# EAGLE design MotorShieldTestbench (EAGLE 8.1.1)
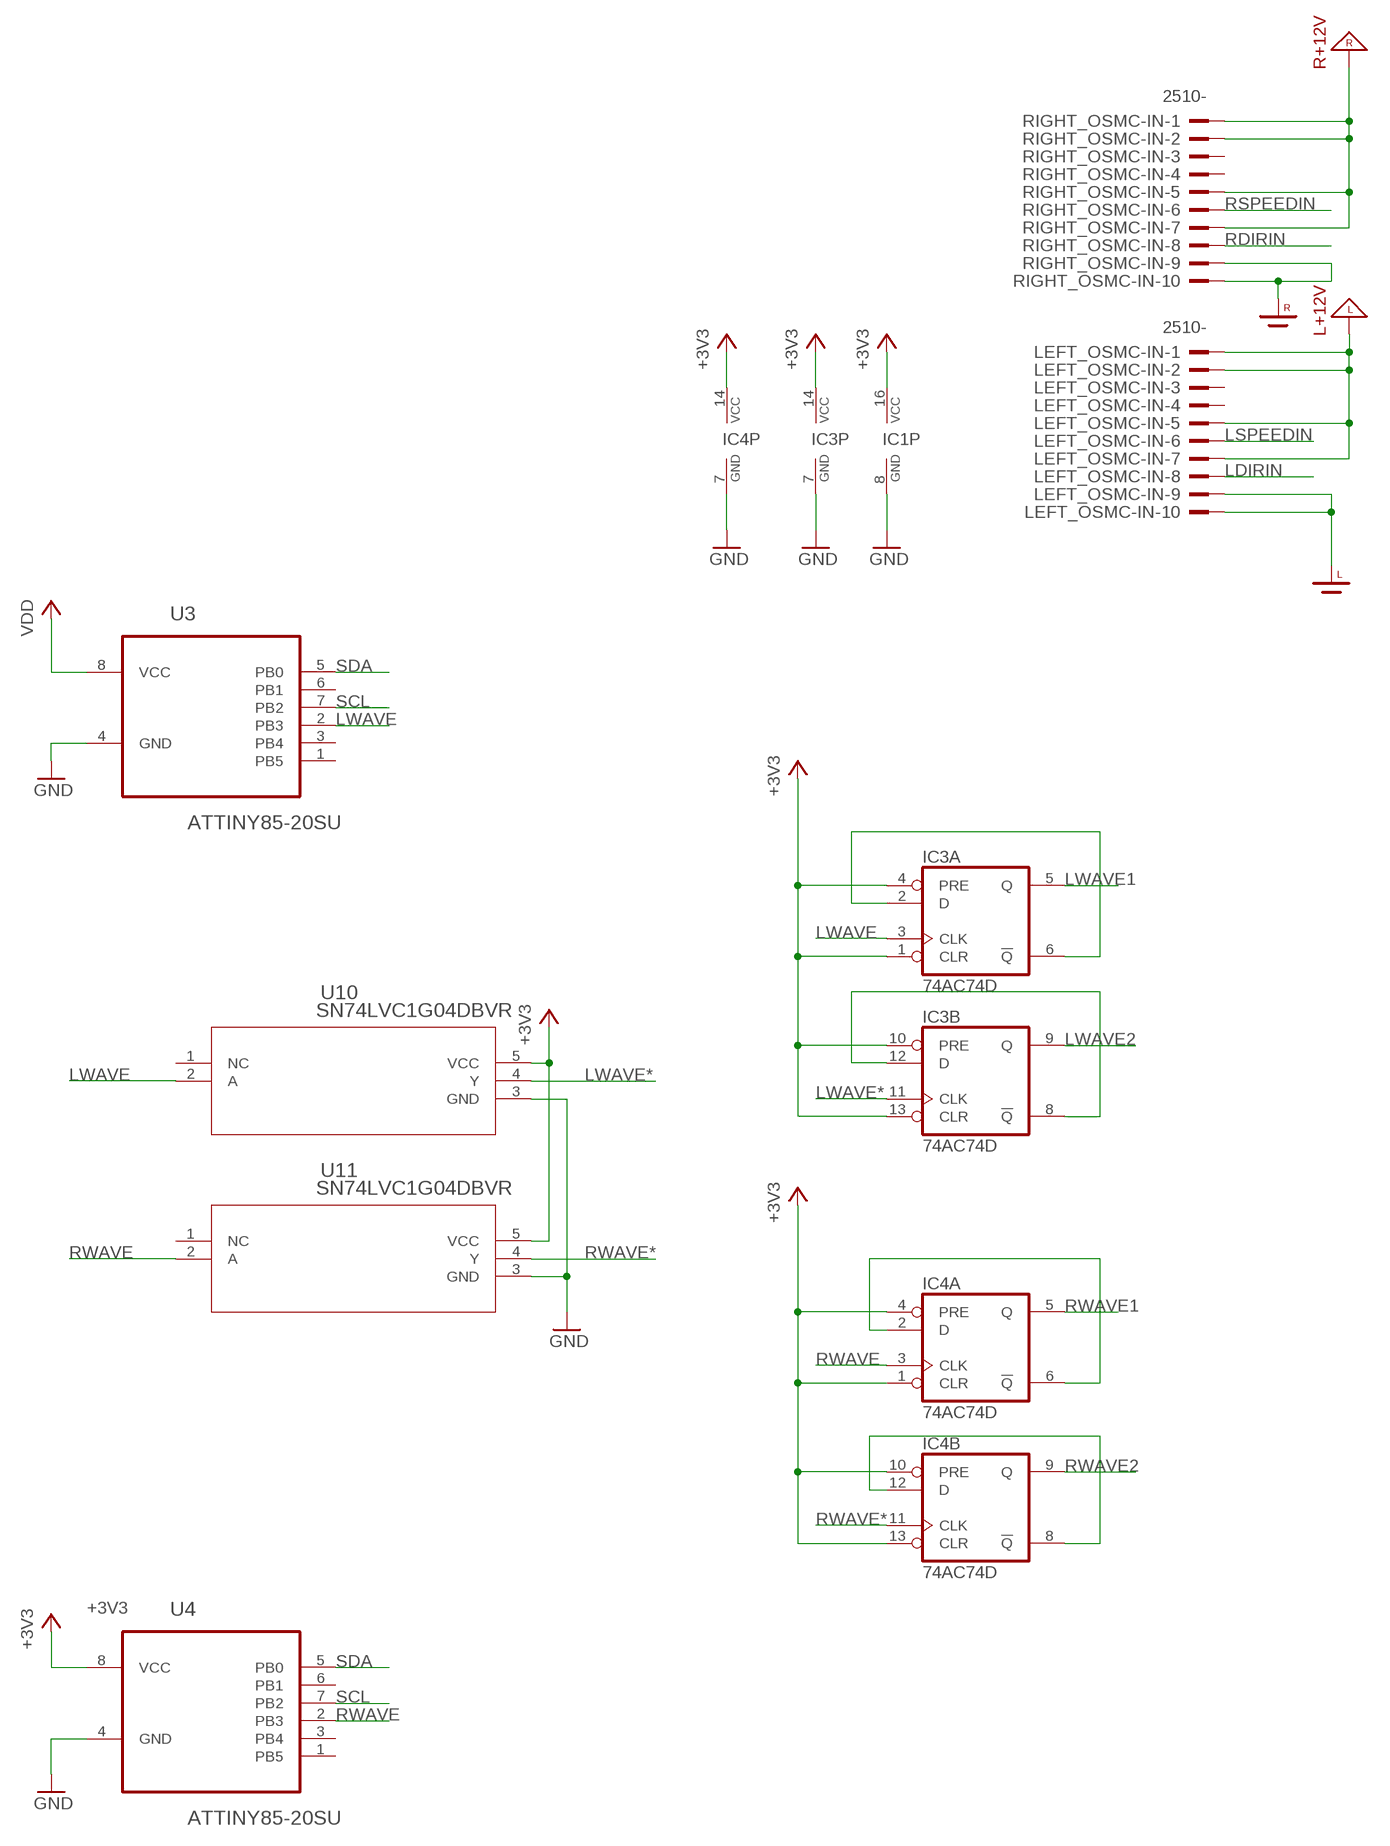
[diagram p0: schematic, sheet 1, part 1 of 2]
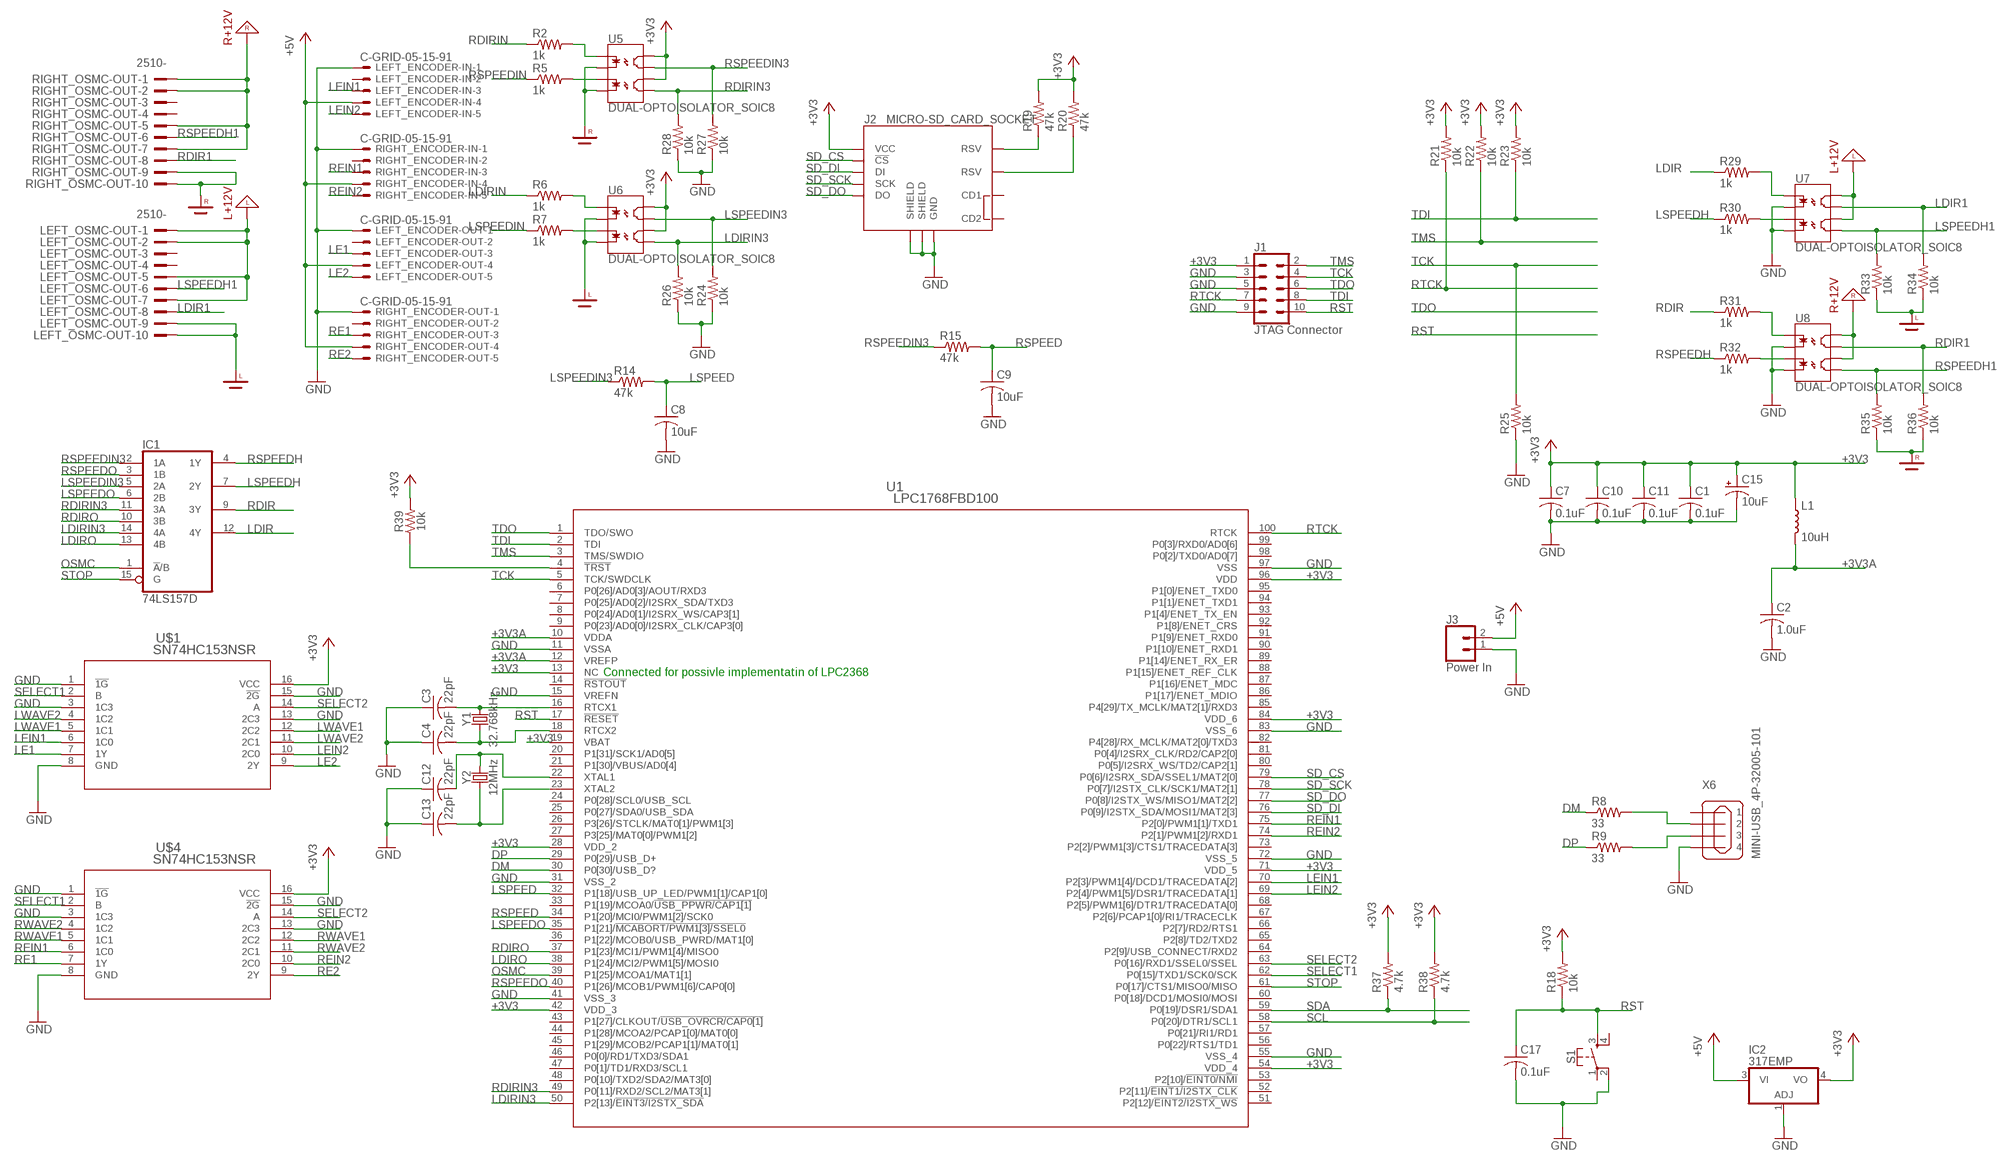
[diagram p1: schematic, sheet 1, part 2 of 2]

## Parts
C1  0.1uF  C-USC0603  [C0603]
C2  1.0uF  C-USC0603  [C0603]
C3  22pF  C-USC0603  [C0603]
C4  22pF  C-USC0603  [C0603]
C7  0.1uF  C-USC0603  [C0603]
C8  10uF  C-USC0603  [C0603]
C9  10uF  C-USC0603  [C0603]
C10  0.1uF  C-USC0603  [C0603]
C11  0.1uF  C-USC0603  [C0603]
C12  22pF  C-USC0603  [C0603]
C13  22pF  C-USC0603  [C0603]
C15  10uF  10UF-POLAR-0603-6.3V-20%(TANT)  [0603-POLAR]
C17  0.1uF  C-USC0603  [C0603]
IC1  74LS157D  [SO16]
IC2  317EMP  [SOT223]
IC3  74AC74D  [SO14]
IC4  74AC74D  [SO14]
J1  JTAG Connector  CONN_05X2SHD  [2X5-SHROUDED]
J2  MICRO-SD_CARD_SOCKET  [MICRO-SD-SOCKET]
J3  Power In  CONN_02POLAR  [MOLEX-1X2]
L1  10uH  INDUCTOR-0603-33NH  [0603]
LEFT_ENCODER-IN  C-GRID-05-15-91  [15-91-05]
LEFT_ENCODER-OUT  C-GRID-05-15-91  [15-91-05]
LEFT_OSMC-IN  2510-  [PAK100/2500-10]
LEFT_OSMC-OUT  2510-  [PAK100/2500-10]
R2  1k  R-US_R0603  [R0603]
R5  1k  R-US_R0603  [R0603]
R6  1k  R-US_R0603  [R0603]
R7  1k  R-US_R0603  [R0603]
R8  33  R-US_R0603  [R0603]
R9  33  R-US_R0603  [R0603]
R14  47k  R-US_R0603  [R0603]
R15  47k  R-US_R0603  [R0603]
R18  10k  R-US_R0603  [R0603]
R19  47k  R-US_R0603  [R0603]
R20  47k  R-US_R0603  [R0603]
R21  10k  R-US_R0603  [R0603]
R22  10k  R-US_R0603  [R0603]
R23  10k  R-US_R0603  [R0603]
R24  10k  R-US_R0603  [R0603]
R25  10k  R-US_R0603  [R0603]
R26  10k  R-US_R0603  [R0603]
R27  10k  R-US_R0603  [R0603]
R28  10k  R-US_R0603  [R0603]
R29  1k  R-US_R0603  [R0603]
R30  1k  R-US_R0603  [R0603]
R31  1k  R-US_R0603  [R0603]
R32  1k  R-US_R0603  [R0603]
R33  10k  R-US_R0603  [R0603]
R34  10k  R-US_R0603  [R0603]
R35  10k  R-US_R0603  [R0603]
R36  10k  R-US_R0603  [R0603]
R37  4.7k  R-US_R0603  [R0603]
R38  4.7k  R-US_R0603  [R0603]
R39  10k  10KOHM-0603-1/10W-1%  [0603]
RIGHT_ENCODER-IN  C-GRID-05-15-91  [15-91-05]
RIGHT_ENCODER-OUT  C-GRID-05-15-91  [15-91-05]
RIGHT_OSMC-IN  2510-  [PAK100/2500-10]
RIGHT_OSMC-OUT  2510-  [PAK100/2500-10]
S1  MOMENTARY-SWITCH-SPST-2-SMD-5.2MM  [TACTILE_SWITCH_SMD_5.2MM]
U1  LPC1768FBD100  [SOT407-1]
U3  ATTINY85-20SU  [SOIC127P798X216-8N]
U4  ATTINY85-20SU  [SOIC127P798X216-8N]
U5  DUAL-OPTOISOLATOR_SOIC8  [SO08]
U6  DUAL-OPTOISOLATOR_SOIC8  [SO08]
U7  DUAL-OPTOISOLATOR_SOIC8  [SO08]
U8  DUAL-OPTOISOLATOR_SOIC8  [SO08]
U10  SN74LVC1G04DBVR  [DBV5]
U11  SN74LVC1G04DBVR  [DBV5]
U$1  SN74HC153NSR  [NS16]
U$4  SN74HC153NSR  [NS16]
X6  MINI-USB_4P-32005-101  [32005-101]
Y1  32.768kHz  CRYSTAL-32.768KHZSMD-3.2X1.5  [CRYSTAL-SMD-3.2X1.5MM]
Y2  12MHz  CRYSTAL-12MHZ"  [CRYSTAL-SMD-5X3.2-4PAD]

## Nets
+3V3: C1.1 C7.1 C10.1 C11.1 C15.+ IC1.16(VCC) IC2.4(VO) IC3.1(A:CLR) IC3.4(A:PRE) IC3.10(B:PRE) IC3.13(B:CLR) IC3.14(P:VCC) IC4.1(A:CLR) IC4.4(A:PRE) IC4.10(B:PRE) IC4.13(B:CLR) IC4.14(P:VCC) J1.1 J2.VCC L1.1 R18.2 R19.2 R20.2 R21.2 R22.2 R23.2 R37.2 R38.2 R39.2 U1.13(NC) U1.19(VBAT) U1.28(VDD_2) U1.42(VDD_3) U1.54(VDD_4) U1.71(VDD_5) U1.84(VDD_6) U1.96(VDD) U3.8(VCC) U4.8(VCC) U5.6(CL2) U5.8(CL1) U6.6(CL2) U6.8(CL1) U10.5(VCC) U11.5(VCC) U$1.16(VCC) U$4.16(VCC) ; supply symbol labelled VDD
+3V3A: C2.1 L1.2 U1.10(VDDA) U1.12(VREFP)
+5V: IC2.3(VI) J3.2 LEFT_ENCODER-IN.4 LEFT_ENCODER-OUT.4 RIGHT_ENCODER-IN.4 RIGHT_ENCODER-OUT.4
DM: R8.1 U1.30(P0[30]/USB_D?)
DP: R9.1 U1.29(P0[29]/USB_D+)
GND: C1.2 C2.2 C3.1 C4.1 C7.2 C8.2 C9.2 C10.2 C11.2 C12.1 C13.1 C15.- C17.2 IC1.8(GND) IC2.1(ADJ) IC3.7(P:GND) IC4.7(P:GND) J1.3 J1.5 J1.9 J2.GND J2.GND1(SHIELD) J2.GND3(SHIELD) J3.1 LEFT_ENCODER-IN.1 LEFT_ENCODER-OUT.1 R24.1 R25.1 R26.1 R27.1 R28.1 RIGHT_ENCODER-IN.1 RIGHT_ENCODER-OUT.1 S1.2 U1.11(VSSA) U1.15(VREFN) U1.31(VSS_2) U1.41(VSS_3) U1.55(VSS_4) U1.72(VSS_5) U1.83(VSS_6) U1.97(VSS) U3.4(GND) U4.4(GND) U7.2(C1) U7.4(C2) U8.2(C1) U8.4(C2) U10.3(GND) U11.3(GND) U$1.1(!1G) U$1.3(1C3) U$1.8(GND) U$1.13(2C3) U$1.15(!2G) U$4.1(!1G) U$4.3(1C3) U$4.8(GND) U$4.13(2C3) U$4.15(!2G) X6.4
L+12V: LEFT_OSMC-IN.1 LEFT_OSMC-IN.2 LEFT_OSMC-IN.5 LEFT_OSMC-IN.7 LEFT_OSMC-OUT.1 LEFT_OSMC-OUT.2 LEFT_OSMC-OUT.5 LEFT_OSMC-OUT.7 U7.6(CL2) U7.8(CL1)
LDIR: IC1.12(4Y) R29.1
LDIR1: LEFT_OSMC-OUT.8 R34.2 U7.7(EM1)
LDIRIN: LEFT_OSMC-IN.8 R6.1
LDIRIN3: IC1.14(4A) R26.2 U1.50(P2[13]/!EINT3/I2STX_SDA) U6.5(EM2)
LDIRO: IC1.13(4B) U1.38(P1[24]/MCI2/PWM1[5]/MOSI0)
LE1: LEFT_ENCODER-OUT.3 U$1.7(1Y)
LE2: LEFT_ENCODER-OUT.5 U$1.9(2Y)
LEIN1: LEFT_ENCODER-IN.3 U1.70(P2[3]/PWM1[4]/DCD1/TRACEDATA[2]) U$1.6(1C0)
LEIN2: LEFT_ENCODER-IN.5 U1.69(P2[4]/PWM1[5]/DSR1/TRACEDATA[1]) U$1.10(2C0)
LGND: LEFT_OSMC-IN.9 LEFT_OSMC-IN.10 LEFT_OSMC-OUT.9 LEFT_OSMC-OUT.10 R33.1 R34.1 U6.2(C1) U6.4(C2)
LSPEED: C8.1 R14.2 U1.32(P1[18]/USB_UP_LED/PWM1[1]/CAP1[0])
LSPEEDH: IC1.7(2Y) R30.1
LSPEEDH1: LEFT_OSMC-OUT.6 R33.2 U7.5(EM2)
LSPEEDIN: LEFT_OSMC-IN.6 R7.1
LSPEEDIN3: IC1.5(2A) R14.1 R24.2 U6.7(EM1)
LSPEEDO: IC1.6(2B) U1.35(P1[21]/!MCABORT/PWM1[3]/SSEL0)
LWAVE: IC3.3(A:CLK) U3.2(PB3) U10.2(A)
LWAVE1: IC3.5(A:Q) U$1.5(1C1) U$1.12(2C2)
LWAVE2: IC3.9(B:Q) U$1.4(1C2) U$1.11(2C1)
LWAVE*: IC3.11(B:CLK) U10.4(Y)
N$1: IC3.2(A:D) IC3.6(A:!Q)
N$4: IC3.8(B:!Q) IC3.12(B:D)
N$5: IC4.2(A:D) IC4.6(A:!Q)
N$6: IC4.8(B:!Q) IC4.12(B:D)
N$8: J2.RSV1(RSV) R19.1
N$11: J2.RSV2(RSV) R20.1
N$12: R7.2 U6.3(A2)
N$13: R9.2 X6.3
N$14: R5.2 U5.3(A2)
N$15: C4.2 U1.18(RTCX2) Y1.P$1
N$16: C3.2 U1.16(RTCX1) Y1.P$2
N$17: C13.2 U1.23(XTAL2) Y2.1
N$18: C12.2 U1.22(XTAL1) Y2.3
N$19: R2.2 U5.1(A1)
N$20: R8.2 X6.2
N$21: R6.2 U6.1(A1)
N$23: R29.2 U7.1(A1)
N$25: R30.2 U7.3(A2)
N$26: R39.1 U1.4(!TRST)
N$36: R31.2 U8.1(A1)
N$37: R32.2 U8.3(A2)
OSMC: IC1.1(!A!/B) U1.39(P1[25]/MCOA1/MAT1[1])
R+12V: RIGHT_OSMC-IN.1 RIGHT_OSMC-IN.2 RIGHT_OSMC-IN.5 RIGHT_OSMC-IN.7 RIGHT_OSMC-OUT.1 RIGHT_OSMC-OUT.2 RIGHT_OSMC-OUT.5 RIGHT_OSMC-OUT.7 U8.6(CL2) U8.8(CL1)
RDIR: IC1.9(3Y) R31.1
RDIR1: R36.2 RIGHT_OSMC-OUT.8 U8.7(EM1)
RDIRIN: R2.1 RIGHT_OSMC-IN.8
RDIRIN3: IC1.11(3A) R28.2 U1.49(P0[11]/RXD2/SCL2/MAT3[1]) U5.5(EM2)
RDIRO: IC1.10(3B) U1.37(P1[23]/MCI1/PWM1[4]/MISO0)
RE1: RIGHT_ENCODER-OUT.3 U$4.7(1Y)
RE2: RIGHT_ENCODER-OUT.5 U$4.9(2Y)
REIN1: RIGHT_ENCODER-IN.3 U1.75(P2[0]/PWM1[1]/TXD1) U$4.6(1C0)
REIN2: RIGHT_ENCODER-IN.5 U1.74(P2[1]/PWM1[2]/RXD1) U$4.10(2C0)
RGND: R35.1 R36.1 RIGHT_OSMC-IN.9 RIGHT_OSMC-IN.10 RIGHT_OSMC-OUT.9 RIGHT_OSMC-OUT.10 U5.2(C1) U5.4(C2)
RSPEED: C9.1 R15.2 U1.34(P1[20]/MCI0/PWM1[2]/SCK0)
RSPEEDH: IC1.4(1Y) R32.1
RSPEEDH1: R35.2 RIGHT_OSMC-OUT.6 U8.5(EM2)
RSPEEDIN: R5.1 RIGHT_OSMC-IN.6
RSPEEDIN3: IC1.2(1A) R15.1 R27.2 U5.7(EM1)
RSPEEDO: IC1.3(1B) U1.40(P1[26]/MCOB1/PWM1[6]/CAP0[0])
RST: C17.1 J1.10 R18.1 S1.3 U1.17(!RESET)
RTCK: J1.7 R21.1 U1.100(RTCK)
RWAVE: IC4.3(A:CLK) U4.2(PB3) U11.2(A)
RWAVE1: IC4.5(A:Q) U$4.5(1C1) U$4.12(2C2)
RWAVE2: IC4.9(B:Q) U$4.4(1C2) U$4.11(2C1)
RWAVE*: IC4.11(B:CLK) U11.4(Y)
SCL: R38.1 U1.58(P0[20]/DTR1/SCL1) U3.7(PB2) U4.7(PB2)
SD_CS: J2.CS(!CS) U1.79(P0[6]/I2SRX_SDA/SSEL1/MAT2[0])
SD_DI: J2.DI U1.76(P0[9]/I2STX_SDA/MOSI1/MAT2[3])
SD_DO: J2.DO U1.77(P0[8]/I2STX_WS/MISO1/MAT2[2])
SD_SCK: J2.SCLK(SCK) U1.78(P0[7]/I2STX_CLK/SCK1/MAT2[1])
SDA: R37.1 U1.59(P0[19]/DSR1/SDA1) U3.5(PB0) U4.5(PB0)
SELECT1: U1.62(P0[15]/TXD1/SCK0/SCK) U$1.2(B) U$4.2(B)
SELECT2: U1.63(P0[16]/RXD1/SSEL0/SSEL) U$1.14(A) U$4.14(A)
STOP: IC1.15(G) U1.61(P0[17]/CTS1/MISO0/MISO)
TCK: J1.4 R25.2 U1.5(TCK/SWDCLK)
TDI: J1.8 R23.1 U1.2(TDI)
TDO: J1.6 U1.1(TDO/SWO)
TMS: J1.2 R22.1 U1.3(TMS/SWDIO)
Unconnected: J2.CD1 J2.CD2 LEFT_ENCODER-IN.2 LEFT_ENCODER-OUT.2 LEFT_OSMC-IN.3 LEFT_OSMC-IN.4 LEFT_OSMC-OUT.3 LEFT_OSMC-OUT.4 RIGHT_ENCODER-IN.2 RIGHT_ENCODER-OUT.2 RIGHT_OSMC-IN.3 RIGHT_OSMC-IN.4 RIGHT_OSMC-OUT.3 RIGHT_OSMC-OUT.4 S1.1 S1.4 U1.6(P0[26]/AD0[3]/AOUT/RXD3) U1.7(P0[25]/AD0[2]/I2SRX_SDA/TXD3) U1.8(P0[24]/AD0[1]/I2SRX_WS/CAP3[1]) U1.9(P0[23]/AD0[0]/I2SRX_CLK/CAP3[0]) U1.14(!RSTOUT) U1.20(P1[31]/SCK1/AD0[5]) U1.21(P1[30]/VBUS/AD0[4]) U1.24(P0[28]/SCL0/USB_SCL) U1.25(P0[27]/SDA0/USB_SDA) U1.26(P3[26]/STCLK/MAT0[1]/PWM1[3]) U1.27(P3[25]/MAT0[0]/PWM1[2]) U1.33(P1[19]/MCOA0/!USB_PPWR/CAP1[1]) U1.36(P1[22]/MCOB0/USB_PWRD/MAT1[0]) U1.43(P1[27]/CLKOUT/!USB_OVRCR/CAP0[1]) U1.44(P1[28]/MCOA2/PCAP1[0]/MAT0[0]) U1.45(P1[29]/MCOB2/PCAP1[1]/MAT0[1]) U1.46(P0[0]/RD1/TXD3/SDA1) U1.47(P0[1]/TD1/RXD3/SCL1) U1.48(P0[10]/TXD2/SDA2/MAT3[0]) U1.51(P2[12]/!EINT2/I2STX_WS) U1.52(P2[11]/!EINT1/I2STX_CLK) U1.53(P2[10]/!EINT0/NMI) U1.56(P0[22]/RTS1/TD1) U1.57(P0[21]/RI1/RD1) U1.60(P0[18]/DCD1/MOSI0/MOSI) U1.64(P2[9]/USB_CONNECT/RXD2) U1.65(P2[8]/TD2/TXD2) U1.66(P2[7]/RD2/RTS1) U1.67(P2[6]/PCAP1[0]/RI1/TRACECLK) U1.68(P2[5]/PWM1[6]/DTR1/TRACEDATA[0]) U1.73(P2[2]/PWM1[3]/CTS1/TRACEDATA[3]) U1.80(P0[5]/I2SRX_WS/TD2/CAP2[1]) U1.81(P0[4]/I2SRX_CLK/RD2/CAP2[0]) U1.82(P4[28]/RX_MCLK/MAT2[0]/TXD3) U1.85(P4[29]/TX_MCLK/MAT2[1]/RXD3) U1.86(P1[17]/ENET_MDIO) U1.87(P1[16]/ENET_MDC) U1.88(P1[15]/ENET_REF_CLK) U1.89(P1[14]/ENET_RX_ER) U1.90(P1[10]/ENET_RXD1) U1.91(P1[9]/ENET_RXD0) U1.92(P1[8]/ENET_CRS) U1.93(P1[4]/ENET_TX_EN) U1.94(P1[1]/ENET_TXD1) U1.95(P1[0]/ENET_TXD0) U1.98(P0[2]/TXD0/AD0[7]) U1.99(P0[3]/RXD0/AD0[6]) U3.1(PB5) U3.3(PB4) U3.6(PB1) U4.1(PB5) U4.3(PB4) U4.6(PB1) U10.1(NC) U11.1(NC) X6.1

## Notes on the sheet
- Connected for possivle implementatin of LPC2368

## Library data of the parts
C1-C4 C7-C13 C17 = rcl:C-US: CAPACITOR, American symbol
C15 = SparkFun-Capacitors:10UF-POLAR: 10.0µF polarized capacitors A capacitor is a passive two-terminal electrical component used to store electrical energy temporarily in an electric field.; PROD_ID: CAP-13210
IC1 = 74xx-eu:74*157: Quadruple 2-line to 1-line data SELECTOR/MULTIPLEXER
IC2 = linear:*317: Positive VOLTAGE REGULATOR
IC3 IC4 = 74xx-eu:74*74: Dual D type positive edge triggered FLIP FLOP, preset and clear
J1 = SparkFun-Connectors:CONN_05X2: Multi connection point. Often used as Generic Header-pin footprint for 0.1 inch spaced/style header connections For AVR SPI programming port, see special device with nice symbol: "AVR_SPI_PROG_5x2.dev" You can populate with any combo of single row headers, but if you'd like an exact match, check these: 2x5 AVR ICSP Male Header <https://www.sparkfun.com/products/778> (PRT-00778) 2x5 Pin Shrouded Header <https://www.sparkfun.com/products/8506> (PRT-08506) On any of the 0.1 inch spaced packages, you can populate with these: Break Away Headers - Straight <https://www.sparkfun.com/products/116> (PRT-00116) Break Away Male Headers - Right Angle <https://www.sparkfun.com/products/553> (PRT-00553) Female Headers <https://www.sparkfun.com/products/115> (PRT-00115) Break Away Headers - Machine Pin <https://www.sparkfun.com/products/117> (PRT-00117) Break Away Female Headers - Swiss Machine Pin <https://www.sparkfun.com/products/743> (PRT-00743) Special note: the shrouded connector mates well with our 5x2 ribbon cables: 2x5 Pin IDC Ribbon Cable <https://www.sparkfun.com/products/8535> (PRT-08535); PROD_ID: CONN-08671; SF_ID: PRT-08506
J2 = SparkFun-Connectors:MICRO-SD_CARD_SOCKET: microSD Socket for Transflash Push-push type µSD socket. tDoc lines correctly indicate media card edge positions when inserting (unlocked, locked, depressed). NOTE: CD1 and CD2 are connected internally, and the default detect state of the socket is detect pin to ground. SparkFun Products: WAV Trigger <https://www.sparkfun.com/products/13660> CAN-Bus Shield <https://www.sparkfun.com/products/13262> SparkFun Level Shifing microSD Breakout <https://www.sparkfun.com/products/13743>; PROD_ID: CONN-07820; SF_ID: PRT-00127
J3 = SparkFun-Connectors:CONN_02: Multi connection point. Often used as Generic Header-pin footprint for 0.1 inch spaced/style header connections On any of the 0.1 inch spaced packages, you can populate with these: Break Away Headers - Straight <https://www.sparkfun.com/products/116> (PRT-00116) Break Away Male Headers - Right Angle <https://www.sparkfun.com/products/553> (PRT-00553) Female Headers <https://www.sparkfun.com/products/115> (PRT-00115) Break Away Headers - Machine Pin <https://www.sparkfun.com/products/117> (PRT-00117) Break Away Female Headers - Swiss Machine Pin <https://www.sparkfun.com/products/743> (PRT-00743) For SCREWTERMINALS and SPRING TERMINALS visit here: Screw Terimnals on SparkFun.com <https://www.sparkfun.com/search/results?term=Screw+Terminals> (5mm/3.5mm/2.54mm spacing) This device is also useful as a general connection point to wire up your design to another part of your project. Our various solder wires solder well into these plated through hole pads. Hook-Up Wire - Assortment (Stranded, 22 AWG) <https://www.sparkfun.com/products/11375> (PRT-11375) Hook-Up Wire - Assortment (Solid Core, 22 AWG) <https://www.sparkfun.com/products/11367> (PRT-11367) View the entire wire category on our website here <https://www.sparkfun.com/categories/141> Special notes: Molex polarized connector foot print use with: PRT-08233 with associated crimp pins and housings. 2.54_SCREWTERM for use with PRT-10571. 3.5mm Screw Terminal footprints for PRT-08084 5mm Screw Terminal footprints for use with PRT-08432; SF_ID: PRT-09918
L1 = SparkFun-Coils:INDUCTOR: Inductors Resist changes in electrical current. Basically a coil of wire. SparkFun Products: SparkFun Load Cell Amplifier - HX711 <https://www.sparkfun.com/products/13879> IOIO-OTG - V2.2 <https://www.sparkfun.com/products/13613>; PROD_ID: NDUC-07874; VALUE: 33nH/±5%/500mA
LEFT_ENCODER-IN LEFT_ENCODER-OUT RIGHT_ENCODER-IN RIGHT_ENCODER-OUT = con-molex:C-GRID-05: CONNECTOR wire to board 2.54 mm (0.100") pitch header; OC_FARNELL: unknown; OC_NEWARK: unknown
LEFT_OSMC-IN LEFT_OSMC-OUT RIGHT_OSMC-IN RIGHT_OSMC-OUT = con-3m:2510-: 3M (TM) Pak 100 4-Wall Header Source: 3M; MF: 3M; MPN: 2510-6002UB; OC_FARNELL: 9838244; OC_NEWARK: 46F4725
R2 R5-R9 R14 R15 R18-R38 = rcl:R-US_: RESISTOR, American symbol
R39 = SparkFun-Resistors:10KOHM: 10kΩ resistor A resistor is a passive two-terminal electrical component that implements electrical resistance as a circuit element. Resistors act to reduce current flow, and, at the same time, act to lower voltage levels within circuits. - Wikipedia; PROD_ID: RES-00824
S1 = SparkFun-Switches:MOMENTARY-SWITCH-SPST-2: Momentary Switch (Pushbutton) - SPST - Two Circuits Normally-open (NO) SPST momentary switches (buttons, pushbuttons). Schematic symbol includes two switch circuits. Variants SMD-4.6MMX2.8MM - 4.60mm x 2.80mm Tactile Momentary Button Switch - Used on SparkFun SAMD21 Mini Breakout <https://www.sparkfun.com/products/13664> SMD-5.2MM - Mini Pushbutton Switch - SMD <https://www.sparkfun.com/products/8720> - Used on Arduino Pro Mini <https://www.sparkfun.com/products/11114>; PROD_ID: SWCH-08247; SF_SKU: COM-08720
U1 = DigiKey:LPC1768FBD100; MANUFACTURER_PART_NUMBER: lpc1768fbd100; VENDOR: NXP
U3 U4 = Atmel_By_element14_Batch_1-00:ATTINY85-20SU: 8-bit Microcontroller with In-System Programmable Flash; MPN: ATTINY85-20SU; OC_FARNELL: 1455164; OC_NEWARK: 58M3797; PACKAGE: SOIC-8; SUPPLIER: Atmel
U5-U8 = SparkFun-DiscreteSemi:DUAL-OPTOISOLATOR: Optocoupler, Phototransistor Output, Dual Channel Optically coupled pairs with a gallium arsenide infrared LED and a silicon NPN phototransistor. Signal information, including a DC level, can be transmitted by the device while maintaining a high degree of electrical isolation between input and output. Datasheet <https://www.sparkfun.com/datasheets/Components/SMD/ild205t.pdf> SparkFun Products: SparkFun Opto-isolator Breakout <https://www.sparkfun.com/products/9118>; PROD_ID: IC-09076
U10 U11 = zilog:SN74LVC1G04DBVR; MANUFACTURER_PART_NUMBER: SN74LVC1G04DBVR; VENDOR: Texas Instruments
U$1 U$4 = DigiKey:SN74HC153NSR; MANUFACTURER_PART_NUMBER: SN74HC153NSR; VENDOR: Vendor
X6 = con-cypressindustries:MINI-USB_4P-: MINI USB 4 Pol. Source: www.cypressindustries.com; OC_FARNELL: unknown; OC_NEWARK: unknown
Y1 = SparkFun-Clocks:CRYSTAL-32.768KHZ: 32.768kHz Crystal Frequency: 32.768kHz Frequency Stability: ±20ppm Load Capacitance: 12.5pF (PTH-2X6 & SMD-3.2X1.5), 6pF (SMD-2X6) SparkFun Products: SparkFun BigTime Watch Kit <https://www.sparkfun.com/products/11734> SparkFun nRF52832 Breakout <https://www.sparkfun.com/products/13990> SparkFun Real Time Clock Module <https://www.sparkfun.com/products/12708>; PROD_ID: XTAL-13062
Y2 = SparkFun-Clocks:CRYSTAL-12MHZ: 12.0MHz Crystal Frequency: 12.0MHz Frequency Tolerance: ±20ppm Load Capacitance: 18pF SparkFun Products: SparkFun Logomatic <https://www.sparkfun.com/products/12772> Pocket AVR Programmer <https://www.sparkfun.com/products/9825>; PROD_ID: XTAL-08297

## Board
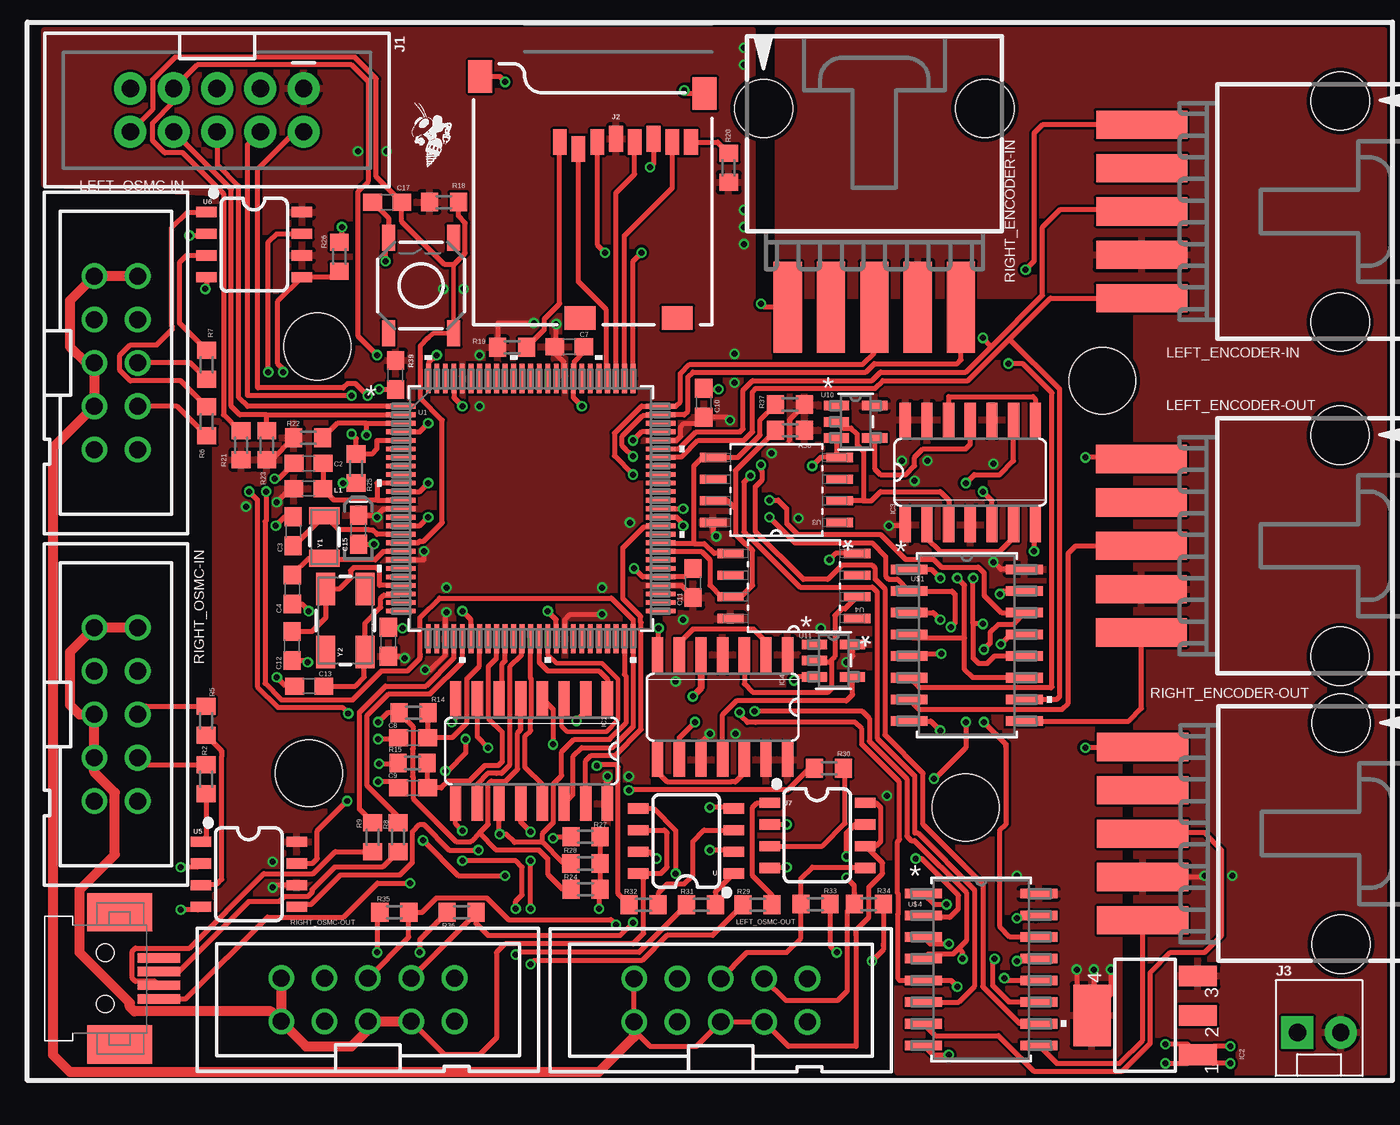
[diagram p2: board, top side]
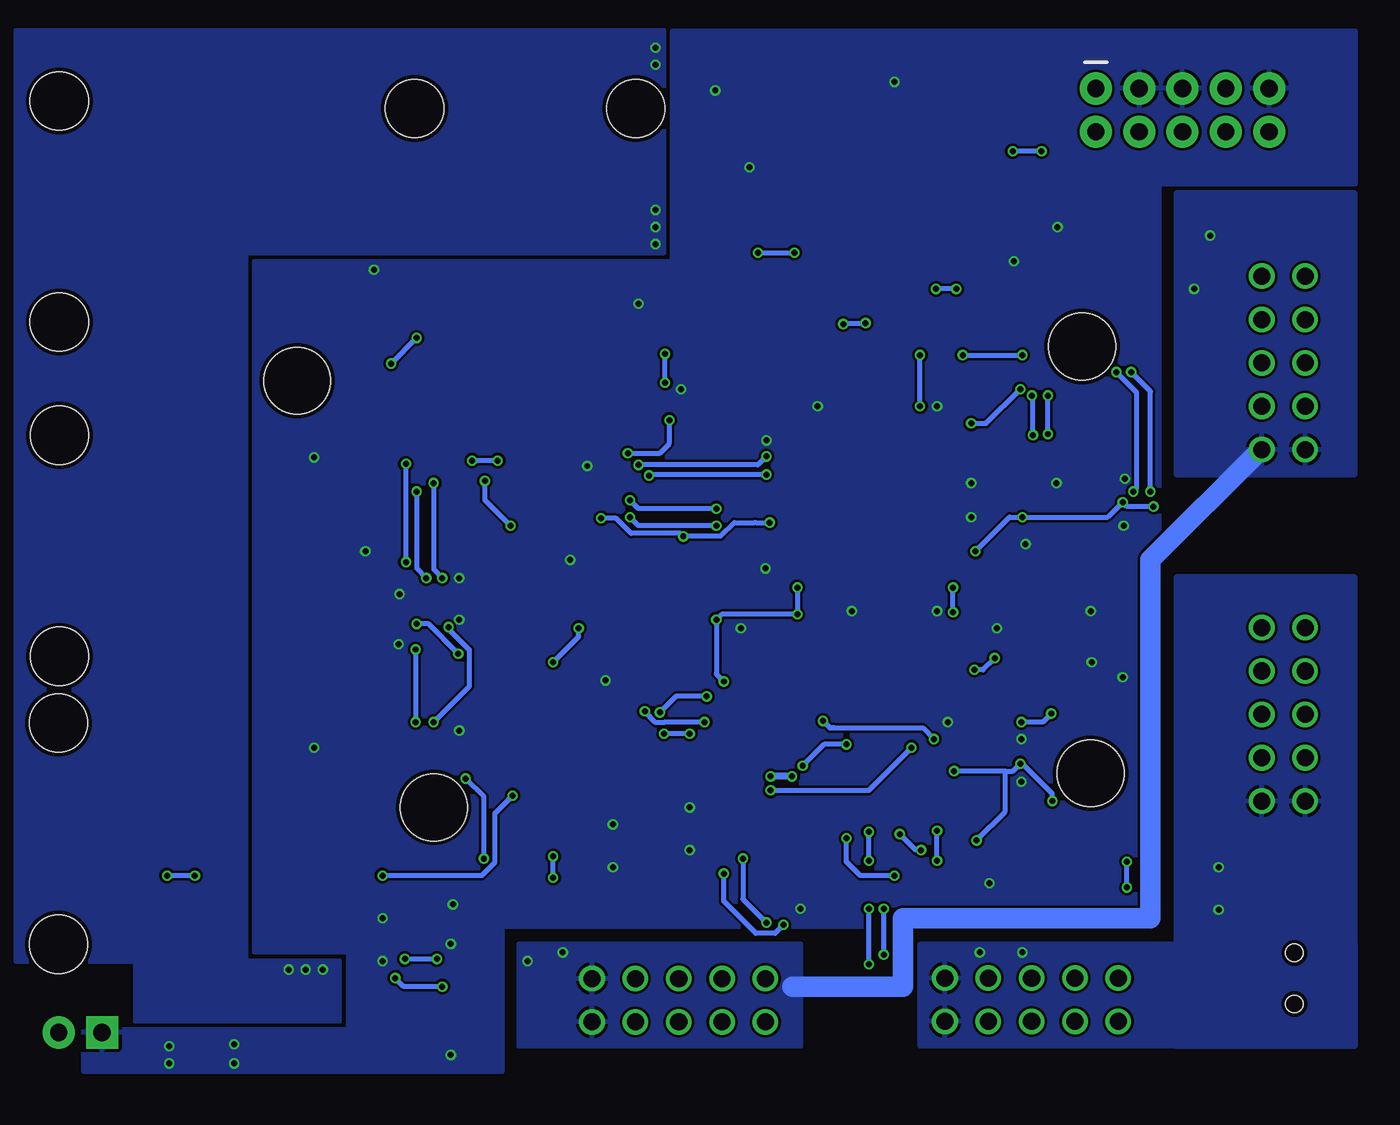
[diagram p3: board, bottom side, seen from below]

No outline drawn. Coordinates in mm, seen from the top.
Copper layers (1*16): Top 0.018mm / dielectric 1.55mm / Bottom 0.018mm
Design rules "eC_2Layer_PClass6_BaseCopperO18_eCDefault *": minimum track width 0.15mm, minimum drill 0.35mm, track to track 0.15mm, track to pad 0.15mm, pad to pad 0.15mm, via to via 0.15mm, smd to smd 0mil, copper to edge 0.25mm, drill to drill 0.35mm, minimum pad ring 0.175mm, minimum via ring 0.125mm, stop-mask expansion 0mil, vias tented up to drill 0.45mm, thermal gap 0.2mm

### Footprints (pad centres in the part's own frame; a part is rotated, then mirrored left to right if it is on the bottom)
STANDOFF-HOLE = hole 3.9: 0,0
C0603 = smd 1.1 x 1: 1 -0.85,0; 2 0.85,0
0603-POLAR = smd 1.1 x 1: + 0.85,0; - -0.85,0
SO16 = smd 0.66 x 2.032: 1 -4.445,-3.073; 2 -3.175,-3.073; 3 -1.905,-3.073; 4 -0.635,-3.073; 5 0.635,-3.073; 6 1.905,-3.073; 7 3.175,-3.073; 8 4.445,-3.073; 9 4.445,3.073; 10 3.175,3.073; 11 1.905,3.073; 12 0.635,3.073; 13 -0.635,3.073; 14 -1.905,3.073; 15 -3.175,3.073; 16 -4.445,3.073
SOT223 = smd 1.219 x 2.235: 1 -2.311,-3.099; 2 0,-3.099; 3 2.311,-3.099 | smd 3.6 x 2.2: 4 0,3.099
SO14 = smd 0.66 x 2.032: 1 -3.81,-3.073; 2 -2.54,-3.073; 3 -1.27,-3.073; 4 0,-3.073; 5 1.27,-3.073; 6 2.54,-3.073; 7 3.81,-3.073; 8 3.81,3.073; 9 2.54,3.073; 10 1.27,3.073; 11 0,3.073; 12 -1.27,3.073; 13 -2.54,3.073; 14 -3.81,3.073
2X5-SHROUDED = drill 1.016 pad 1.88: 1 -1.27,5.08; 2 1.27,5.08; 3 -1.27,2.54; 4 1.27,2.54; 5 -1.27,0; 6 1.27,0; 7 -1.27,-2.54; 8 1.27,-2.54; 9 -1.27,-5.08; 10 1.27,-5.08
MICRO-SD-SOCKET = smd 1.8 x 1.4: CD1 -2.05,0.4; CD2 -7.75,0.4 | smd 0.8 x 1.5: CS -7.84,10.3; DI -6.74,10.7; DO -2.34,10.7; GND -3.44,10.9; RSV1 -8.94,10.7; RSV2 -1.24,10.7; SCLK -4.54,10.7; VCC -5.64,10.9 | smd 1.4 x 1.9: GND1 -13.6,14.55; GND3 -0.45,13.55
MOLEX-1X2 = drill 1.016 pad 1.88 square: 1 0,0 | drill 1.016 pad 1.88: 2 2.54,0
0603 = smd 1.1 x 1: 1 -0.85,0; 2 0.85,0
15-91-05 = smd 1.651 x 5.334: 1 -5.08,-10.795; 2 -2.54,-10.795; 3 0,-10.795; 4 2.54,-10.795; 5 5.08,-10.795 | hole 3.404: -6.477,0.838; 6.477,0.838
PAK100/2500-10 = drill 1 pad 1.422: 1 -5.08,-1.27; 2 -5.08,1.27; 3 -2.54,-1.27; 4 -2.54,1.27; 5 0,-1.27; 6 0,1.27; 7 2.54,-1.27; 8 2.54,1.27; 9 5.08,-1.27; 10 5.08,1.27
R0603 = smd 1 x 1.1: 1 -0.85,0; 2 0.85,0
TACTILE_SWITCH_SMD_5.2MM = smd 1.524 x 0.762: 1 -2.794,1.905; 2 2.794,1.905; 3 -2.794,-1.905; 4 2.794,-1.905
SOT407-1 = smd 1.727 x 0.279: 1 -7.62,6; 2 -7.62,5.5; 3 -7.62,5; 4 -7.62,4.5; 5 -7.62,4; 6 -7.62,3.5; 7 -7.62,3; 8 -7.62,2.5; 9 -7.62,2; 10 -7.62,1.5; 11 -7.62,1; 12 -7.62,0.5; 13 -7.62,0; 14 -7.62,-0.5; 15 -7.62,-1; 16 -7.62,-1.5; 17 -7.62,-2; 18 -7.62,-2.5; 19 -7.62,-3; 20 -7.62,-3.5; 21 -7.62,-4; 22 -7.62,-4.5; 23 -7.62,-5; 24 -7.62,-5.5; 25 -7.62,-6; 51 7.62,-6; 52 7.62,-5.5; 53 7.62,-5; 54 7.62,-4.5; 55 7.62,-4; 56 7.62,-3.5; 57 7.62,-3; 58 7.62,-2.5; 59 7.62,-2; 60 7.62,-1.5; 61 7.62,-1; 62 7.62,-0.5; 63 7.62,0; 64 7.62,0.5; 65 7.62,1; 66 7.62,1.5; 67 7.62,2; 68 7.62,2.5; 69 7.62,3; 70 7.62,3.5; 71 7.62,4; 72 7.62,4.5; 73 7.62,5; 74 7.62,5.5; 75 7.62,6 | smd 0.279 x 1.727: 26 -6,-7.62; 27 -5.5,-7.62; 28 -5,-7.62; 29 -4.5,-7.62; 30 -4,-7.62; 31 -3.5,-7.62; 32 -3,-7.62; 33 -2.5,-7.62; 34 -2,-7.62; 35 -1.5,-7.62; 36 -1,-7.62; 37 -0.5,-7.62; 38 0,-7.62; 39 0.5,-7.62; 40 1,-7.62; 41 1.5,-7.62; 42 2,-7.62; 43 2.5,-7.62; 44 3,-7.62; 45 3.5,-7.62; 46 4,-7.62; 47 4.5,-7.62; 48 5,-7.62; 49 5.5,-7.62; 50 6,-7.62; 76 6,7.62; 77 5.5,7.62; 78 5,7.62; 79 4.5,7.62; 80 4,7.62; 81 3.5,7.62; 82 3,7.62; 83 2.5,7.62; 84 2,7.62; 85 1.5,7.62; 86 1,7.62; 87 0.5,7.62; 88 0,7.62; 89 -0.5,7.62; 90 -1,7.62; 91 -1.5,7.62; 92 -2,7.62; 93 -2.5,7.62; 94 -3,7.62; 95 -3.5,7.62; 96 -4,7.62; 97 -4.5,7.62; 98 -5,7.62; 99 -5.5,7.62; 100 -6,7.62
SOIC127P798X216-8N = smd 1.549 x 0.533: 1 -3.708,1.905; 2 -3.708,0.635; 3 -3.708,-0.635; 4 -3.708,-1.905; 5 3.708,-1.905; 6 3.708,-0.635; 7 3.708,0.635; 8 3.708,1.905
SO08 = smd 0.6 x 1.2: 1 -1.905,-2.8; 2 -0.635,-2.8; 3 0.635,-2.8; 4 1.905,-2.8; 5 1.905,2.8; 6 0.635,2.8; 7 -0.635,2.8; 8 -1.905,2.8
DBV5 = smd 1.473 x 0.559: 1 -1.118,0.95; 2 -1.118,0; 3 -1.118,-0.95; 4 1.118,-0.95; 5 1.118,0.95
NS16 = smd 2.159 x 0.559: 1 -3.378,4.445; 2 -3.378,3.175; 3 -3.378,1.905; 4 -3.378,0.635; 5 -3.378,-0.635; 6 -3.378,-1.905; 7 -3.378,-3.175; 8 -3.378,-4.445; 9 3.378,-4.445; 10 3.378,-3.175; 11 3.378,-1.905; 12 3.378,-0.635; 13 3.378,0.635; 14 3.378,1.905; 15 3.378,3.175; 16 3.378,4.445
32005-101 = smd 2.5 x 0.55: 1 3.15,1.2; 2 3.15,0.4; 3 3.15,-0.4; 4 3.15,-1.2 | smd 3.8 x 2.25: M1 0.85,3.875; M2 0.85,-3.875 | hole 1: 0,1.5; 0,-1.5
CRYSTAL-SMD-3.2X1.5MM = smd 1 x 1.8: P$1 -1.25,0; P$2 1.25,0
CRYSTAL-SMD-5X3.2-4PAD = smd 1.9 x 1.1: 1 -1.85,-1.15; 2 1.85,-1.15; 3 1.85,1.15; 4 -1.85,1.15

### Placement (x,y rotation side)
22,1  [STANDOFF-HOLE]  22,51 0 top
22,2  [STANDOFF-HOLE]  21.5,26 0 top
22,3  [STANDOFF-HOLE]  60,24 0 top
22,4  [STANDOFF-HOLE]  68,49 0 top
C1  26.16,33.7 90 top
C2  21.48,44.16 180 top
C3  20.59,40.17 270 top
C4  20.54,36.77 90 top
C7  36.76,50.98 0 top
C8  27.61,28.08 180 top
C9  27.61,25.14 180 top
C10  44.65,47.7 90 top
C11  44.02,37.15 90 top
C12  20.52,33.46 90 top
C13  21.52,31.11 0 top
C15  24.41,40.26 90 top
C17  26.09,59.46 180 top
IC1  34.55,27.3 180 top
IC2  70.5,11.81 90 top
IC3  60.26,43.63 0 top
IC4  45.75,29.87 180 top
J1  16.12,64.85 270 top
J2  45.14,52.27 0 top
J3  79.44,10.81 0 top
L1  21.47,42.67 0 top
LEFT_ENCODER-IN  81.1,58.91 270 top
LEFT_ENCODER-OUT  81.09,39.33 270 top
LEFT_OSMC-IN  10.2,50.04 270 top
LEFT_OSMC-OUT  45.64,12.7 0 top
R2  15.48,25.65 270 top
R5  15.48,29.08 270 top
R6  15.52,46.61 90 top
R7  15.52,49.92 90 top
R8  26.73,22.26 270 top
R9  25.23,22.26 270 top
R14  27.64,29.54 0 top
R15  27.58,26.6 0 top
R18  29.41,59.46 180 top
R19  33.41,50.96 180 top
R20  46.1,61.47 270 top
R21  17.54,45.22 270 top
R22  21.47,45.65 180 top
R23  19.04,45.22 270 top
R24  37.71,19.21 180 top
R25  24.27,43.85 90 top
R26  23.29,56.27 270 top
R27  37.7,22.27 180 top
R28  37.7,20.71 180 top
R29  47.8,18.29 0 top
R30  51.99,26.29 0 top
R31  44.49,18.29 0 top
R32  41.12,18.29 0 top
R33  51.19,18.34 180 top
R34  54.31,18.34 180 top
R35  26.51,17.85 0 top
R36  30.45,17.85 0 top
R37  49.7,47.6 0 top
R38  49.7,46.1 0 top
R39  26.59,49.33 90 top
RIGHT_ENCODER-IN  54.64,64.1 0 top
RIGHT_ENCODER-OUT  81.16,22.46 270 top
RIGHT_OSMC-IN  10.2,29.45 270 top
RIGHT_OSMC-OUT  24.96,12.73 0 top
S1  28.08,54.57 90 top
U1  34.5,41.5 0 top
U3  48.9,42.59 180 top
U4  49.92,36.97 180 top
U5  17.99,20.08 270 top
U6  18.3,56.97 270 top
U7  51.3,22.36 270 top
U8  43.6,22.03 90 top
U10  53.54,46.59 0 top
U11  52.25,32.6 0 top
U$1  60.06,33.5 0 top
U$4  60.9,14.5 0 top
U$16  [ROBOBUZZ_0.2X]  28.44,61.5 0 top
X6  9.56,13.98 0 top
Y1  22.41,39.84 90 top
Y2  23.64,34.95 90 top

### Tracks (layer width: path | path; a pad name or v marks a point on that pad's centre or on a via)
+3V3  (via drill 0.35)
  Top 0.3: C15.+ 25.49,41.11 25.87,41.49 U1.13 | U1.71 43.05,45.5 43.28,45.74 43.28,46.28 43.5,46.5 44.29,46.5 C10.1 46.02,46.85 v46.19,46.69 | U1.54 43.31,37 C11.1 | U1.84 36.44,49.18 36.44,50.11 35.91,50.64 C7.1 36,51.07 v36,52.31 | R37.2 49.66,46.7 49.66,45.5 | IC3.1 56.4,40.5 v55.5,40.5 | R23.2 19.34,44.37 R22.2 | U1.42 36.5,35 36.81,35.31 v38.69,35.31 | U1.19 28.25,38.5 v28.25,39 | v29.56,35.44 29.5,35.38 U1.28 29.5,32.95 28.61,32.06 v28.31,32.06 | C1.1 27.02,32.85 v27.12,32.75 | v34.69,52.38 32.56,52.38 R19.2 | v53,32.5 53.37,32.87 U11.5 | U5.6 19.51,19.45 v19.38,19.31 | v19.62,41.88 20.42,42.67 L1.1 | v66.5,14.5 66.5,13 | v67.5,14.5 67.5,13 | v68.5,14.5 68.5,13 | IC4.10 44.48,27.79 v45,28.31 | U3.8 45.19,40.06 v45.38,39.88 | U$1.16 62.05,37.95 v61.62,38.38
  Top 0.406: 25.49,41.11 25.5,41.11 v25.5,41 | IC1.16 v38.99,25.81 v39,25.81
  Bottom 0.3: v46.44,48.88 v46.44,50.56 | v56.25,44.31 v57.75,44.31 | 41.12,40.69 v40.31,40.69 | v55.5,40.5 57,42 v57,43.12 | v29.38,54.38 v30.56,54.38 | v61.62,38.38 v61.62,44.12 | v24.38,62.44 v26.06,62.44 | v43,31.38 43.44,31.81 v43.44,35 43.12,35.31 v38.69,35.31 v38.69,36.88 | v48.62,44.75 46.75,44.75 46.19,45.31 v46.19,46.69 | v50.19,40.94 49.31,40.94 48.43,40.05 45.55,40.05 v45.38,39.88 45.35,39.9 43.19,39.9 42.4,40.69 41.19,40.69 | v45,28.31 v46.5,28.31 | v29.56,35.44 v29.56,36.88 | v31.5,47.5 v31.5,50.5 | v36,52.31 35.94,52.38 v34.69,52.38 | v53,32.5 51.5,34 v51.5,34.5 | v19.38,19.31 v19.38,20.81 | v17.81,41.62 19.38,41.62 v19.62,41.88 20.5,41 v25.5,41 26.25,41 v28.25,39 | v55.38,24.69 56.42,23.64 56.42,20.76 57.19,20 v63,20 | v27.12,32.75 27.81,32.06 v28.31,32.06
  Bottom 0.406: v39,25.81 v40.25,25.81
  other vias: 47,68.5 47,67.5 47,59 47,58 47,57
  pour Top: 6,69.5 6,60.5 16,60 16,16.5 35.5,17 56,17 56,8.5 69,8.5 69,53 47.5,53 47.5,69.5
  pour Bottom: 65.5,11.5 65.5,15 71,15 71,56.5 46.5,56.5 46.5,69.5 84.5,69.5 84.5,15 77.5,15 77.5,11.5
+3V3A
  Top 0.3: 25.5,42 U1.12 | 25.5,42 22.99,42 L1.2 22.34,42.68 C2.1 | U1.10 25.5,43 25.5,42
+5V  (via drill 0.35)
  Top 0.3: RIGHT_ENCODER-OUT.4 73.92,19.92 v74,20
  Bottom 0.3: v74,20 v75.62,20
  pour Top: 70,8.5 84.5,8.5 84.5,69.5 49,69.5 49,64 49,54 70,54 70,50.5
DM
  Top 0.3: R8.1 26.73,23.46 24.93,25.26 24.93,29.4 26.18,30.65 28.61,30.65 30.5,32.54 U1.30
DP
  Top 0.3: R9.1 25.23,23.14 24.48,23.89 24.48,29.59 25.99,31.1 28.36,31.1 29.94,32.67 | 29.94,32.67 29.88,32.62 29.94,32.67 | 29.94,32.67 30,32.74 U1.29
GND  (via drill 0.35)
  Top 0.25: S1.2 26,57.19 v26,56
  Top 0.3: U1.11 28,42.5 v28.5,43 | U1.15 28,40.5 v28.5,41 | U1.31 31,35 v30.5,35.5 | U1.41 36,35 v35.5,35.5 | U1.72 41,46 v40.5,45.5 | v37.5,47.5 37,48 U1.83 37.06,49.18 37.06,50.11 37.61,50.66 C7.2 | U1.97 30,48 v30.5,47.5 | J2.GND 41.7,61.7 v41.5,61.5 | J2.GND3 43.68,65.82 v43.5,66 | J2.GND1 32.68,66.82 v33,66.5 | C12.1 21.33,32.61 v21.44,32.5 | C4.1 21.08,35.92 v21.5,35.5 | C15.- 25.22,39.41 | 25.22,39.41 25.31,39.5 | 25.22,39.41 25.3,39.41 v25.31,39.42 | U4.4 52.38,38.88 v52,38.5 | C11.2 43.52,37.5 U1.55 41.06,37.5 v40.56,38 | v51,44 51.5,44.5 U3.4 52.42,44.68 U10.3 | U$1.3 58.09,35.41 v58.5,35 | U$1.13 62.63,34.13 v62.06,33.56 | U$1.15 62.17,36.67 v62,36.5 | U$1.8 57.95,29.05 v58.5,28.5 | U$4.3 57.93,16 v59,16 | U$4.15 64.1,17.5 v63,17.5 | U$4.13 64.14,15 v63,15 | U$4.8 58.08,9.5 v59,9.5 | U7.2 v49.5,23 | U7.4 48.55,20.5 v49.5,20.5 | C9.2 26.41,25.5 v25.56,25.5 | C8.2 26.68,28 v25.56,28 | R25.1 v23.5,43 | C17.2 26.17,58.53 S1.2 | C10.2 44.7,48.5 v45.5,48.5 | IC4.7 42,33 v42,34.5 | IC3.7 64,40.48 v64,39 | X6.4 14.28,12.78 19.07,17.57 23.53,17.57 25.52,19.56 v27.44,19.56 | IC2.1 72.97,10.12 v71.69,10.12 | v71.69,9 73,9 | v75.5,10 74.5,10 | v75.5,9 74.5,9 | v19.5,43.25 19.73,43.25 C2.2 | v38.5,18.06 38.5,19.15 R24.1 38.56,20.71 R28.1 | R27.1 R28.1 | R28.1 38.56,20.7 | RIGHT_ENCODER-OUT.1 70.32,27.5 v67,27.5 | LEFT_ENCODER-OUT.1 70.2,44.5 v67,44.5 | LEFT_ENCODER-IN.1 64.49,63.99 64,63.5 64,56 v63.5,55.5 | RIGHT_ENCODER-IN.1 48.2,53.3 v48,53.5 | v29.88,29 30.11,29.23 IC1.8 | U11.3 50.15,31.65 v49.94,31.44 | U$4.1 58.15,18.31 v58.88,18.31 | R26.1 23.44,57.27 v23.44,58 | C13.1 20.14,31.11 v19.62,31.62 | C3.1 20.08,41.02 v19.56,40.5 | U$1.1 57.99,37.95 v58.5,37.44
  Top 0.3: U8.4 46.34,24 v45,24 | U8.2 46.3,21.5 v45,21.5 | C1.2 26.95,34.55 v27,34.5
  pour Bottom: 6,60.5 17.5,60.5 17.5,17 56,17 56,8.5 80.5,8.5 80.5,11 65,11 65,15.5 70.5,15.5 70.5,56 46,56 46,69.5 6,69.5
L+12V
  Top 0.3: U7.8 54.73,24.27 55,24 55,22 54.73,21.73 U7.6 54.15,21.73 55,20.88 55.12,20.75 55.12,20.12 54.31,19.31 54.31,17.56 53.56,16.81 53.56,16.5 | 53.56,16.65 53.56,16.5 | 53.56,16.5 53.56,10 49.61,10 LEFT_OSMC-OUT.7 LEFT_OSMC-OUT.5 44.21,10 41.5,10 40.56,10.94 LEFT_OSMC-OUT.1 LEFT_OSMC-OUT.2
  Top 0.6: LEFT_OSMC-IN.2 LEFT_OSMC-IN.1 7.5,53.69 7.5,51 8.46,50.04 LEFT_OSMC-IN.5 LEFT_OSMC-IN.7 6.5,45.07 6.5,9.5 7.5,8.5 38.5,8.5 40.56,10.56 LEFT_OSMC-OUT.1
LDIR  (via drill 0.35)
  Top 0.3: R29.1 45.16,16.5 42.5,16.5 41.02,15.02 34.71,15.02 v34.5,14.81 | v34.5,18.06 v34.5,20.88 | v34.5,22.56 33.91,23.15 IC1.12
  Bottom 0.3: v34.5,14.81 v34.5,18.06 | v34.5,20.88 v34.5,22.56
LDIR1  (via drill 0.35)
  Top 0.3: 53.46,19 R34.2 | 53.46,19 53.46,19.16 | v53,21.12 53,22.5 53.49,23 U7.7 | LEFT_OSMC-OUT.8 49.46,12.69 52.5,12.69 53.06,13.25 53.06,17.93 R34.2 | 53.46,19 53.46,19.41 v53,19.88 | R34.2 53.46,19
  Bottom 0.3: v53,19.88 v53,21.12
LDIRIN
  Top 0.3: R6.1 13.78,47.5 LEFT_OSMC-IN.8
LDIRIN3  (via drill 0.35)
  Top 0.3: R26.2 22.93,55.06 U6.5 19.65,53.62 19.65,50.03 20,49.68 v20,49.5 | v19,42.5 19,40.81 18.93,40.74 18.93,31.26 19.88,30.3 24.07,30.3 25.76,32 27.28,32 28.01,32.73 28.01,33 | 28.01,33 28.01,32.79 | 28.01,33 28.01,35.12 29.15,36.26 39.24,36.26 40.5,35 U1.50 40.52,33.85 40.52,28.75 39.27,27.5 37.5,27.5 36.95,26.95 36.95,24.73 IC1.14
  Bottom 0.3: v20,49.5 18.8,48.3 18.8,42.7 v19,42.5
LDIRO
  Top 0.3: IC1.13 35.19,25.32 34.19,26.32 34.19,28.18 34.5,28.5 34.5,29.19 34.55,29.23 34.55,31.51 34.5,31.56 U1.38
LE1
  Top 0.3: U$1.7 57.26,29.75 65.64,29.75 66,30.1 66,38.88 66.45,39.33 LEFT_ENCODER-OUT.3
LE2
  Top 0.3: U$1.9 69.56,29.05 70.3,29.8 LEFT_ENCODER-OUT.5
LEIN1  (via drill 0.35)
  Top 0.3: U1.70 43.18,45 44.19,46.01 46.77,46.01 46.95,46.18 46.95,48.45 47.5,49 54.5,49 55,49.5 60,49.5 61.5,51 | U$1.6 57.28,31 65,31 65.05,31.05 65.05,48.29 63.34,50 v62.5,50 | 61.5,51 64.5,54 64.5,58 65.5,59 70.22,59 LEFT_ENCODER-IN.3 | 61.5,51 v61,51.5
  Bottom 0.3: v61,51.5 v62.5,50
LEIN2
  Top 0.3: U1.69 42.17,44.55 43.37,44.55 44.32,45.5 47,45.5 47.5,46 47.5,48.36 47.69,48.55 54.69,48.55 55.14,49 60.14,49 62.57,51.43 | LEFT_ENCODER-IN.5 64.97,53.83 62.57,51.43 | U$1.10 65.33,30.32 65.5,30.5 65.5,48.5 62.57,51.43
LGND  (via drill 0.35)
  Top 0.3: R34.1 55.16,16 55.16,15.91 55.16,15.66 v54.5,15 | U6.2 15.39,57.5 v14.5,57.5 | 15.44,55 U6.4 15.5,54.44 v15.44,54.38 | v52.44,15.5 52.04,15.9 R33.1
  Bottom 1.2: LEFT_OSMC-IN.10 11.54,44.96 18,38.5 18,17.5 32.5,17.5 32.5,13.5 38.97,13.5
  pour Bottom: 6,60 16.5,60 16.5,43.5 6,43.5
  pour Bottom: 38.5,15 38.5,10 55,10 55,16 38.5,16
LSPEED
  Top 0.3: U1.32 31.5,32.27 30.75,31.51 30.75,28.93 29.9,28.08 C8.1 28.49,28.11 R14.2
LSPEEDH  (via drill 0.35)
  Top 0.3: R30.1 50.82,26.29 49.56,25.03 40.28,25.03 v40.25,25 | v32,27.5 31.38,28.12 IC1.7
  Bottom 0.3: v40.25,25 34.5,25 v32,27.5
LSPEEDH1
  Top 0.3: U7.5 54.05,20.5 51,20.5 50.34,19.84 R33.2 50.34,16.34 49.5,15.5 47.17,15.5 LEFT_OSMC-OUT.6
LSPEEDIN
  Top 0.3: R7.1 14.55,50.04 LEFT_OSMC-IN.6
LSPEEDIN3  (via drill 0.35)
  Top 0.3: 36.86,19.23 R24.2 36.38,19.21 35.5,20.09 35.5,21 35,21.5 32.5,21.5 31.5,22.5 | U6.7 19.61,57.6 19.12,57.12 v19.12,49.5 | 33.91,28.82 IC1.5 33.91,28.55 | v18,42.5 18.48,42.02 18.48,31.07 19.7,29.86 23.46,29.86 v23.81,29.5 | 31.5,22.5 31,22 30.13,22 27.61,24.52 27.61,25.77 27.58,25.8 27.58,27.42 27.61,27.46 27.61,28.71 R14.1 26.1,29.54 v25.56,29 | 31.5,22.5 32.01,23 32.01,25.37 32,25.37 32.02,25.37 32.19,25.54 33.04,25.54 33.73,26.23 33.73,28.37 33.91,28.55 | 33.91,29 33.91,28.55
  Bottom 0.3: v23.81,29.5 24.31,29 v25.56,29 | v18,42.5 18,48.38 v19.12,49.5
LSPEEDO
  Top 0.3: IC1.6 32.83,30.55 32.83,32.41 33,32.59 U1.35
LWAVE
  Top 0.3: 54,41.96 U3.2 | 54,41.96 54.46,41.96 55,42.5 58.5,42.5 59,42 IC3.3 | U10.2 52.79,46.22 53.28,46.22 53.62,45.88 53.62,45.24 54,44.86 54,41.96
LWAVE1  (via drill 0.35)
  Top 0.3: IC3.5 61.53,41.97 v61,42.5 | U$1.12 61.68,32.87 61.24,32.42 60.76,32.42 60.42,32.76 60.42,34.75 | 60.42,34.75 60.42,37.42 v60.44,37.44 | U$1.5 56.82,33 v58.56,33 | v61,34.75 60.42,34.75
  Bottom 0.3: v61,42.5 61,38 v60.44,37.44 | v58.56,33 60.31,34.75 v61,34.75
LWAVE2  (via drill 0.35)
  Top 0.3: 62.5,31.5 62.59,31.59 U$1.11 60.41,31.59 59.93,32.07 59.93,33.93 | 56.82,33.99 U$1.4 56.89,33.93 59.93,33.93 | v60,43 60.5,43.5 62,43.5 62.8,44.3 IC3.9 | 59.91,37.02 v59.5,37.44 59.93,37.01 59.93,33.93
  Bottom 0.3: v60,43 60,37.94 v59.5,37.44
LWAVE*
  Top 0.3: U10.4 54.66,43.84 55,43.5 56.5,43.5 57,44 57,44.5 57.5,45 60,45 60.26,45.26 IC3.11
N$1
  Top 0.3: IC3.2 57.72,39.78 58.5,39 62,39 62.8,39.8 IC3.6
N$4
  Top 0.3: IC3.12 59,48.06 63.94,48.06 64.07,47.93 IC3.8
N$5
  Top 0.3: IC4.2 48.29,33.71 47.56,34.44 44,34.44 43.21,33.65 IC4.6
N$6
  Top 0.3: IC4.12 47.02,26.02 46.5,25.5 46.22,25.5 46.2,25.48 42.52,25.48 42,26 42,26.74 IC4.8
N$8
  Top 0.3: R19.1 35.3,52 35.3,52.61 36.2,53.51 J2.RSV1
N$11
  Top 0.3: J2.RSV2 45.45,62.97 R20.1
N$12
  Top 0.3: R7.2 13.93,52.37 13.93,55.92 14.34,56.34 U6.3
N$13
  Top 0.3: X6.3 12.48,13.8 11.34,13.8 11.16,13.98 11.16,15.58 11.34,15.76 14.5,15.76 18.86,20.11 21.75,20.11 23.04,21.41 R9.2
N$14
  Top 0.3: 15.48,27.97 R5.2 16.41,27.3 16.41,27.17 16.41,27 16.41,19.78 16.12,19.5 15.24,19.5 U5.3
N$15
  Top 0.3: U1.18 25.87,38.99 25.38,38.51 22.49,38.51 Y1.P$1 21.5,38.59 C4.2
N$16
  Top 0.3: U1.16 25.5,40 25.25,40.25 25.04,40.25 25.03,40.26 23.24,40.26 Y1.P$2 | Y1.P$2 22.91,41.09 | C3.2 20.64,39.32 Y1.P$2
N$17
  Top 0.3: U1.23 26.82,36.44 25.89,36.44 25.72,36.26 25.72,35.71 24.79,34.78 Y2.1 24.75,33.06 24.75,31.62 24.23,31.11 C13.2
N$18
  Top 0.3: U1.22 25.64,37 25.64,37.87 25.46,38.05 24.12,38.05 23.94,37.87 23.94,37.44 23.3,36.8 Y2.3 22.5,35.12 21.68,34.31 C12.2
N$19
  Top 0.3: R2.2 15.48,22.28 U5.1
N$20
  Top 0.3: X6.2 13.88,14.38 18,18.5 19.79,18.5 20.06,18.77 21.44,18.77 21.69,19.02 21.69,19.19 23,20.5 25.82,20.5 R8.2
N$21
  Top 0.3: R6.2 13.99,48.99 11.04,48.99 10.42,49.6 10.42,50.48 11.04,51.09 12.59,51.09 13.5,52 13.5,52.16 13.47,52.18 13.47,57.98 14.38,58.88 U6.1
N$23
  Top 0.3: R29.2 48.65,18.85 47.5,20 47.5,24 47.77,24.27 U7.1
N$25
  Top 0.3: U7.3 51.59,21.73 52.93,23.07 52.93,26.2 R30.2
N$26  (via drill 0.35)
  Top 0.3: U1.4 28,46 v28.5,46.5 | v25.62,48.5 26.57,48.5 R39.1
  Bottom 0.3: v28.5,46.5 27.62,46.5 v25.62,48.5
N$36
  Top 0.3: 45.34,19.04 R31.2 | 45.34,19.04 45.34,19 45.34,19.04 | 45.34,19.04 45.34,19.07 U8.1
N$37
  Top 0.3: U8.3 44.67,22.67 44,22 44,20 43.5,19.5 42.5,19.5 41.97,18.97 R32.2
OSMC
  Top 0.3: U1.39 35,32.5 35.5,32 38.5,32 39,31.5 IC1.1
R+12V
  Top 0.3: RIGHT_OSMC-OUT.7 29.46,9.5 31.5,9.5 32.5,10.5 32.5,15.5 33,16 40.5,16 41.12,16.62 41.12,19.81 U8.8 42.13,20.13 42.5,20.5 42.5,22.5 42.33,22.67 U8.6
  Top 0.6: RIGHT_OSMC-IN.2 RIGHT_OSMC-IN.1 7.5,33.1 7.5,30 8.05,29.45 RIGHT_OSMC-IN.5 RIGHT_OSMC-IN.7 8.93,26.07 10.13,24.87 10.13,21.24 8.06,19.17 8.06,15.49 11.01,12.54 11.01,12.32 11.27,12.05 19.29,12.05 RIGHT_OSMC-OUT.1 | RIGHT_OSMC-OUT.2 RIGHT_OSMC-OUT.1 | RIGHT_OSMC-OUT.1 21.34,10 24,10 24.96,10.96 RIGHT_OSMC-OUT.5 RIGHT_OSMC-OUT.7
RDIR  (via drill 0.35)
  Top 0.3: R31.1 40.85,15.5 33.75,15.5 v33.62,15.38 | v30.5,22.62 30.11,23.02 IC1.9 | v33.62,18.06 33.62,18.5 34,18.88 34,20.5 33.64,20.86 30.51,20.86 v30.5,20.88
  Bottom 0.3: v33.62,15.38 v33.62,18.06 | v30.5,20.88 v30.5,22.62
RDIR1  (via drill 0.35)
  Top 0.3: RIGHT_OSMC-OUT.8 31.3,17.8 R36.2 31.3,17.2 32,16.5 39.75,16.5 v40.5,17.25 | U8.7 41.48,21.4 v41.88,21
  Bottom 0.3: v41.88,21 41.88,18.62 v40.5,17.25
RDIRIN
  Top 0.3: RIGHT_OSMC-IN.8 11.88,26.5 R2.1
RDIRIN3  (via drill 0.35)
  Top 0.3: U1.49 40,31.77 40.08,31.7 40.08,28.94 39.12,27.99 37.05,27.99 36.31,27.25 36.31,25.86 35.83,25.37 35.83,23.1 35.18,22.45 35.18,21.96 35.19,21.95 | R28.2 36.85,20.8 36.34,20.8 35.19,21.95 | 35.19,21.95 33.55,21.95 33.06,22.44 v32.69,22.44 32.65,22.48 IC1.11 | U5.5 20.94,18.32 21.63,18.32 23.35,20.05 26.84,20.05 27.58,20.79 27.58,22.58 28,23 28.23,23 29.73,21.5 v31.44,21.5
  Bottom 0.3: v31.44,21.5 31.75,21.5 v32.69,22.44
RDIRO
  Top 0.3: U1.37 33.94,33.82 33.94,32.89 33.27,32.23 33.27,29.5 | 33.27,29.5 33.27,29.23 | 33.27,29.5 33.28,29.49 33.28,28.81 | IC1.10 31.38,25.38 31.98,25.99 32.49,25.99 32.5,26 32.78,26 33.28,26.5 33.28,28.81 | 33.28,28.81
RE1
  Top 0.3: U$4.7 58.21,10.63 61.92,10.63 64,8.55 69.19,8.55 70.81,10.18 70.81,14.31 72,15.5 74,15.5 75,16.5 75,21.5 74,22.5 70.4,22.5 RIGHT_ENCODER-OUT.3
RE2
  Top 0.3: U$4.9 65.33,9 69,9 70.36,10.36 RIGHT_ENCODER-OUT.5
REIN1  (via drill 0.35)
  Top 0.3: RIGHT_ENCODER-IN.3 54.64,50.64 53.95,49.95 43.81,49.95 43.27,49.41 43.27,47.77 43,47.5 U1.75 41.01,47.5 41,47.51 39.41,45.92 39.41,44.59 v40.5,43.5 | v47.38,43.44 47,43.06 47,40.14 47.24,39.89 47.3,39.89 50.29,36.9 54.53,36.9 54.8,36.63 54.8,28.06 57,25.86 57,22.5 57.19,22.5 60.5,19.19 60.5,13.5 59.59,12.6 U$4.6
  Bottom 0.3: v40.5,43.5 47.31,43.5 v47.38,43.44
REIN2  (via drill 0.35)
  Top 0.3: RIGHT_ENCODER-IN.5 59.72,50.22 59.5,50 54.64,50 54.14,49.5 44,49.5 43.72,49.22 43.72,47.22 43.5,47 U1.74 42.06,46.94 41.06,46.94 39.86,45.74 39.86,45.2 39.93,45.14 | 48,43.81 v48,44.06 48,43.75 48.08,43.68 48.08,43.2 47.66,42.79 47.66,40.16 50.47,37.35 51.91,37.35 52.73,38.17 54.53,38.17 54.7,38 54.7,37.36 55.25,36.81 55.25,28.25 57.5,26 57.5,23 61,19.5 61,13.5 63.17,11.32 U$4.10 | 39.93,45.14 v40.5,44.56 | 39.93,45.14 40.03,45.03 39.93,45.14
  Bottom 0.3: v40.5,44.56 41,44.06 v48,44.06
RGND  (via drill 0.35)
  Top 0.3: R36.1 28,16.25 v28,15.5 | R35.1 25.5,17.69 v25.5,15.5 | U5.2 14.97,20.5 v14,20.5 | U5.4 15.01,18 v14,18
  pour Bottom: 6,37.5 16.5,37.5 16.5,10 6,10
  pour Bottom: 6,16 6,10 31.5,10 31.5,16
RSPEED
  Top 0.3: U1.34 32.5,32.73 32.02,32.24 32.02,29.23 32.82,28.42 32.82,26.68 32.6,26.45 31.8,26.45 30.93,25.57 30.93,25.54 29.65,25.54 29.25,25.14 C9.1 28.43,25.18 R15.2 28.58,26.45
RSPEEDH  (via drill 0.35)
  Top 0.3: R32.1 39.62,18.93 39.62,26.38 39.5,26.5 38.44,26.5 v38.38,26.44 | IC1.4 35.81,29.75 v35.81,27.69
  Bottom 0.3: v35.81,27.69 37.12,27.69 v38.38,26.44
RSPEEDH1  (via drill 0.35)
  Top 0.3: RIGHT_OSMC-OUT.6 27.36,16.4 R35.2 28.13,17.85 28.98,18.7 31.92,18.7 33.2,17.43 39.2,17.43 v39.5,17.12 | U8.5 41.7,23.94 43,22.64 v43,20.12
  Bottom 0.3: v39.5,17.12 40,16.62 41.12,16.62 43,18.5 v43,20.12
RSPEEDIN
  Top 0.3: RIGHT_OSMC-IN.6 11.95,29.93 R5.1
RSPEEDIN3  (via drill 0.35)
  Top 0.3: v25.62,26.56 26.69,26.56 R15.1 | U5.7 21.71,20.71 22,21 22,22.62 v23.75,24.38 | v30.69,28 30.69,27.19 29.62,26.12 v29.5,26.12 | v28.19,22.06 30.25,20 v33,20 | v35.81,22.19 35.9,22.27 R27.2 | IC1.2 37.73,29.6 v37.19,29.06
  Bottom 0.3: v23.75,24.38 23.75,24.81 25.5,26.56 v25.62,26.56 26.06,26.12 26.5,26.12 | v30.69,28 31.34,28.66 36.66,28.66 | v33,20 35,20 35.81,20.81 v35.81,22.19 | 36.5,28.66 36.66,28.66 | 36.66,28.66 36.78,28.66 | 36.78,28.66 v37.19,29.06 | 26.5,26.12 v29.5,26.12 | v28.19,22.06 26.5,23.75 26.5,26.12 | 36.78,28.66 36.66,28.66
RSPEEDO
  Top 0.25: U1.40 35.5,32.95 36,32.45 38.69,32.45 39.62,31.51 39.62,29.12 38.94,28.44 36.62,28.44 36.31,28.75 36.31,28.81 | 36.31,28.81 36.31,30.23 | 36.31,28.81 36.31,29 36.31,28.81
  Top 0.3: 36.5,30.33 IC1.3 36.31,30.23
RST
  Top 0.25: S1.3 30.02,51.74 30.02,51.5 | 28.5,51.5 28.78,51.78 S1.3 | 29.98,55.8 S1.3
  Top 0.3: 28.5,51.5 28.04,51.04 28.04,47.96 29.31,46.69 29.31,40.69 28.23,39.6 28,39.6 27.9,39.5 U1.17 | J1.10 12.34,64.88 12.34,66.63 13.66,67.95 24.19,67.95 25.45,66.69 25.45,60.95 C17.1 26.95,58.32 29.47,55.8 29.98,55.8 30.66,56.48 30.66,58.25 30.27,58.65 R18.1
RTCK  (via drill 0.35)
  Top 0.3: U1.100 28.56,49.18 28.56,50.11 28.74,50.28 28.78,50.28 v29,50.5 | v25.5,50.5 24.39,51.6 24.39,60.08 25,60.69 25,66.5 24,67.5 14.96,67.5 J1.7 13.58,65.33 12.34,64.09 12.34,63.06 13.06,62.34 14.12,62.34 16.5,59.96 16.5,47 17.43,46.07 R21.1
  Bottom 0.3: v29,50.5 v25.5,50.5
RWAVE
  Top 0.3: U4.2 52.92,35.63 52.73,35.63 52.33,35.23 52.33,32.83 52.17,32.67 | 52.17,32.67 52,32.5 51.23,32.5 U11.2 | IC4.3 47.02,31.23 47.5,30.75 51.92,30.75 52.17,30.99 52.17,32.67
RWAVE1  (via drill 0.35)
  Top 0.3: v59.5,13.5 59.13,13.87 U$4.5 56.13,13.87 56,14 56,17.7 56.01,17.71 56.01,18.96 56,18.97 56,22 56.11,22.11 56.1,22.13 56.1,25.49 53.9,27.69 53.9,28.6 53.5,29 47.69,29 47.68,28.99 47.2,28.99 46.86,29.32 46.86,29.45 v46.75,29.56 | v62.25,14 62.38,13.87 U$4.12
  Top 0.406: IC4.5 44.48,30.98 v44,30.5
  Bottom 0.3: v44,30.5 45.81,30.5 v46.75,29.56 | v62.25,14 61.75,13.5 v59.5,13.5
RWAVE2  (via drill 0.35)
  Top 0.3: v47.62,29.62 53.94,29.62 54.35,29.21 54.35,27.88 56.55,25.68 56.55,22.31 56.81,22.05 57,22.05 60.02,19.03 60.02,16.18 59.58,15.73 | U$4.4 57.79,15.4 59.25,15.4 59.58,15.73 | v59.81,15.12 59.81,15.5 59.58,15.73 | U$4.11 62.54,12.6 61.57,13.57 61.57,15.01 v61.69,15.12 | IC4.9 43.21,28.09 v44.12,29
  Bottom 0.3: v44.12,29 46.46,29 46.5,28.96 47,28.96 47.35,29.31 47.35,29.35 v47.62,29.62 | v61.69,15.12 v59.81,15.12
RWAVE*
  Top 0.3: IC4.11 45.75,29.44 46.55,30.24 53,30.24 53.37,30.6 U11.4
SCL
  Top 0.3: U1.58 44.5,39 45,38.5 45,37 45.66,36.34 U4.7 46.84,36.34 47.5,37 47.5,39.05 47.11,39.44 47.06,39.44 46.5,40 46.5,41.5 | 46.5,41.5 46,42 45.23,42 U3.7 | R38.1 48.4,45.65 48.4,45.63 46.5,43.73 46.5,41.5
SD_CS
  Top 0.3: U1.79 38.94,49.18 38.94,53.15 37.3,54.78 J2.CS
SD_DI  (via drill 0.35)
  Top 0.3: U1.76 40.5,56 v41,56.5 | J2.DI 38.4,56.96 v38.86,56.5
  Bottom 0.3: v41,56.5 v38.86,56.5
SD_DO
  Top 0.3: U1.77 40,57.5 42.8,60.3 J2.DO
SD_SCK
  Top 0.3: U1.78 39.5,60 40.6,61.1 J2.SCLK
SDA
  Top 0.3: R37.1 47.95,46.7 47.95,45.81 46.64,44.5 U3.5 44.56,44.5 44.06,44 44.06,39.45 | U1.59 42.17,39.45 44.06,39.45 | U4.5 45.26,38.88 44.69,39.45 44.06,39.45
SELECT1  (via drill 0.35)
  Top 0.3: U1.62 43.05,41 43.44,40.61 v43.44,40.5 | v48.5,41 50,39.5 54.5,39.5 55.3,38.7 55.3,37.54 55.48,37.37 55.99,37.37 U$1.2 59.2,36.67 59.38,36.5 59.38,34.81 v59.12,34.56 | v60,29 60,27.5 58.19,25.69 v58.12,25.69 | v57.06,21 57.42,21 59.58,18.84 59.57,18.83 59.57,18.05 59.07,17.55 57.65,17.55 U$4.2
  Bottom 0.3: v43.44,40.5 48,40.5 v48.5,41 | v60,29 57.92,31.07 57.92,33.24 59.12,34.44 v59.12,34.56 | v57.06,21 57.06,24.62 v58.12,25.69
SELECT2  (via drill 0.35)
  Top 0.3: U1.63 v43.44,41.5 | v48.5,42 49,42 49.5,41.5 49.5,40.64 50.14,40 55,40 56.48,38.52 58.11,38.52 58.56,38.08 60.74,38.08 61.08,37.74 61.08,36.42 62.09,35.41 U$1.14 62.75,34.71 61.9,34.71 61.42,34.24 61.42,33.61 v61.06,33.25 | U$4.14 62.59,16.41 62,17 62,22.68 62.35,23.03 62.35,27.65 | 62.35,27.65 62.35,27.5 62.35,27.65 | 62.35,27.65 62.35,27.71 v61.06,29
  Bottom 0.3: v43.44,41.5 48,41.5 v48.5,42 | v61.06,33.25 v61.06,29
STOP
  Top 0.3: IC1.15 37.73,26.73 38.05,27.05 39.46,27.05 40.98,28.57 40.98,34.83 40.95,34.86 40.95,35.19 39.9,36.23 39.9,39.21 41.13,40.44 42.06,40.44 U1.61
TCK  (via drill 0.35)
  Top 0.3: U1.5 25.5,45.5 25.5,45 25.2,44.7 R25.2 24.27,45.6 v24,45.88 | v24,48.12 17.91,48.12 17.91,62.83 J1.4
  Bottom 0.3: v24,45.88 v24,48.12
TDI
  Top 0.3: 19.04,47 U1.2 | 19.04,47 17.45,47 16.95,47.5 16.95,60.2 J1.8 | R23.1 19.04,47
TDO
  Top 0.3: J1.6 16.15,63.55 16.15,61.65 17.4,60.39 17.4,48 17.9,47.5 U1.1
TMS  (via drill 0.35)
  Top 0.3: 24.88,46.5 U1.3 | 24.88,46.5 23.17,46.5 R22.1 | v24.94,48.12 | v24.94,48.12 24.24,48.83 23.76,48.83 23.51,48.58 18.5,48.58 18.5,61.38 20.7,63.58 J1.2 | v24.88,45.81 24.88,46.5
  Bottom 0.3: v24.88,45.81 24.88,48.06 v24.94,48.12

### Text on the board
Document: RoboJackets